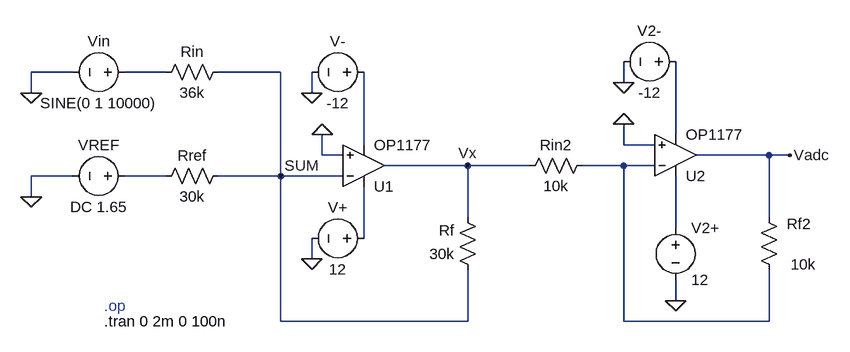
[diagram p0: schematic AFE_LevelShifter.asc]
AFE_LevelShifter.asc, the LTspice schematic file:
Version 4
SHEET 1 1208 680
WIRE 32 -128 -32 -128
WIRE 176 -128 112 -128
WIRE 352 -128 256 -128
WIRE 880 -112 880 -144
WIRE -32 -96 -32 -128
WIRE 400 -96 400 -128
WIRE 960 -32 960 -144
WIRE 480 -16 480 -128
WIRE 880 -16 880 -48
WIRE 928 -16 880 -16
WIRE 416 0 416 -32
WIRE 448 0 416 0
WIRE 1104 0 992 0
WIRE 1136 0 1104 0
WIRE 640 16 512 16
WIRE 736 16 640 16
WIRE 880 16 816 16
WIRE 928 16 880 16
WIRE 32 32 -32 32
WIRE 176 32 112 32
WIRE 352 32 352 -128
WIRE 352 32 256 32
WIRE 448 32 352 32
WIRE -32 64 -32 32
WIRE 640 96 640 16
WIRE 1104 96 1104 0
WIRE 960 112 960 32
WIRE 480 128 480 48
WIRE 400 160 400 128
WIRE 960 224 960 192
WIRE 352 256 352 32
WIRE 640 256 640 176
WIRE 640 256 352 256
WIRE 880 256 880 16
WIRE 1104 256 1104 176
WIRE 1104 256 880 256
FLAG 352 32 SUM
FLAG 416 -32 0
FLAG -32 -96 0
FLAG -32 64 0
FLAG 400 -96 0
FLAG 400 160 0
FLAG 880 -48 0
FLAG 640 16 Vx
FLAG 1136 0 Vadc
FLAG 880 -112 0
FLAG 960 224 0
SYMBOL voltage 128 -128 R90
WINDOW 0 -32 56 VBottom 2
WINDOW 3 32 56 VTop 2
SYMATTR InstName Vin
SYMATTR Value SINE(0 1 10000)
SYMBOL voltage 128 32 R90
WINDOW 0 -32 56 VBottom 2
WINDOW 3 32 56 VTop 2
SYMATTR InstName VREF
SYMATTR Value DC 1.65
SYMBOL res 272 -144 R90
WINDOW 0 0 56 VBottom 2
WINDOW 3 32 56 VTop 2
SYMATTR InstName Rin
SYMATTR Value 36k
SYMBOL res 272 16 R90
WINDOW 0 0 56 VBottom 2
WINDOW 3 32 56 VTop 2
SYMATTR InstName Rref
SYMATTR Value 30k
SYMBOL res 656 192 R180
WINDOW 0 36 76 Left 2
WINDOW 3 36 40 Left 2
SYMATTR InstName Rf
SYMATTR Value 30k
SYMBOL OpAmps\\OP1177 480 80 M180
SYMATTR InstName U1
SYMBOL voltage 496 -128 R90
WINDOW 0 -32 56 VBottom 2
WINDOW 3 32 56 VTop 2
SYMATTR InstName V-
SYMATTR Value -12
SYMBOL voltage 496 128 R90
WINDOW 0 -32 56 VBottom 2
WINDOW 3 32 56 VTop 2
SYMATTR InstName V+
SYMATTR Value 12
SYMBOL res 832 0 R90
WINDOW 0 0 56 VBottom 2
WINDOW 3 32 56 VTop 2
SYMATTR InstName Rin2
SYMATTR Value 10k
SYMBOL OpAmps\\OP1177 960 64 M180
SYMATTR InstName U2
SYMBOL res 1120 192 R180
WINDOW 0 -49 86 Left 2
WINDOW 3 -56 24 Left 2
SYMATTR InstName Rf2
SYMATTR Value 10k
SYMBOL voltage 976 -144 R90
WINDOW 0 -32 56 VBottom 2
WINDOW 3 32 56 VTop 2
SYMATTR InstName V2-
SYMATTR Value -12
SYMBOL voltage 960 96 R0
SYMATTR InstName V2+
SYMATTR Value 12
TEXT 80 232 Left 2 ;.op
TEXT 80 256 Left 2 !.tran 0 2m 0 100n

The netlist it stands for:
* AFE_LevelShifter.asc
Vin N001 0 SINE(0 1 10000)
VREF N005 0 DC 1.65
Rin SUM N001 36k
Rref SUM N005 30k
Rf SUM Vx 30k
XU1 0 SUM N007 N003 Vx OP1177  ; pins In+ In- V+ V- OUT
V- N003 0 -12
V+ N007 0 12
Rin2 N004 Vx 10k
XU2 0 N004 N006 N002 Vadc OP1177  ; pins In+ In- V+ V- OUT
Rf2 N004 Vadc 10k
V2- N002 0 -12
V2+ N006 0 12
* .op
.tran 0 2m 0 100n
.lib ADI1.lib
.backanno
.end